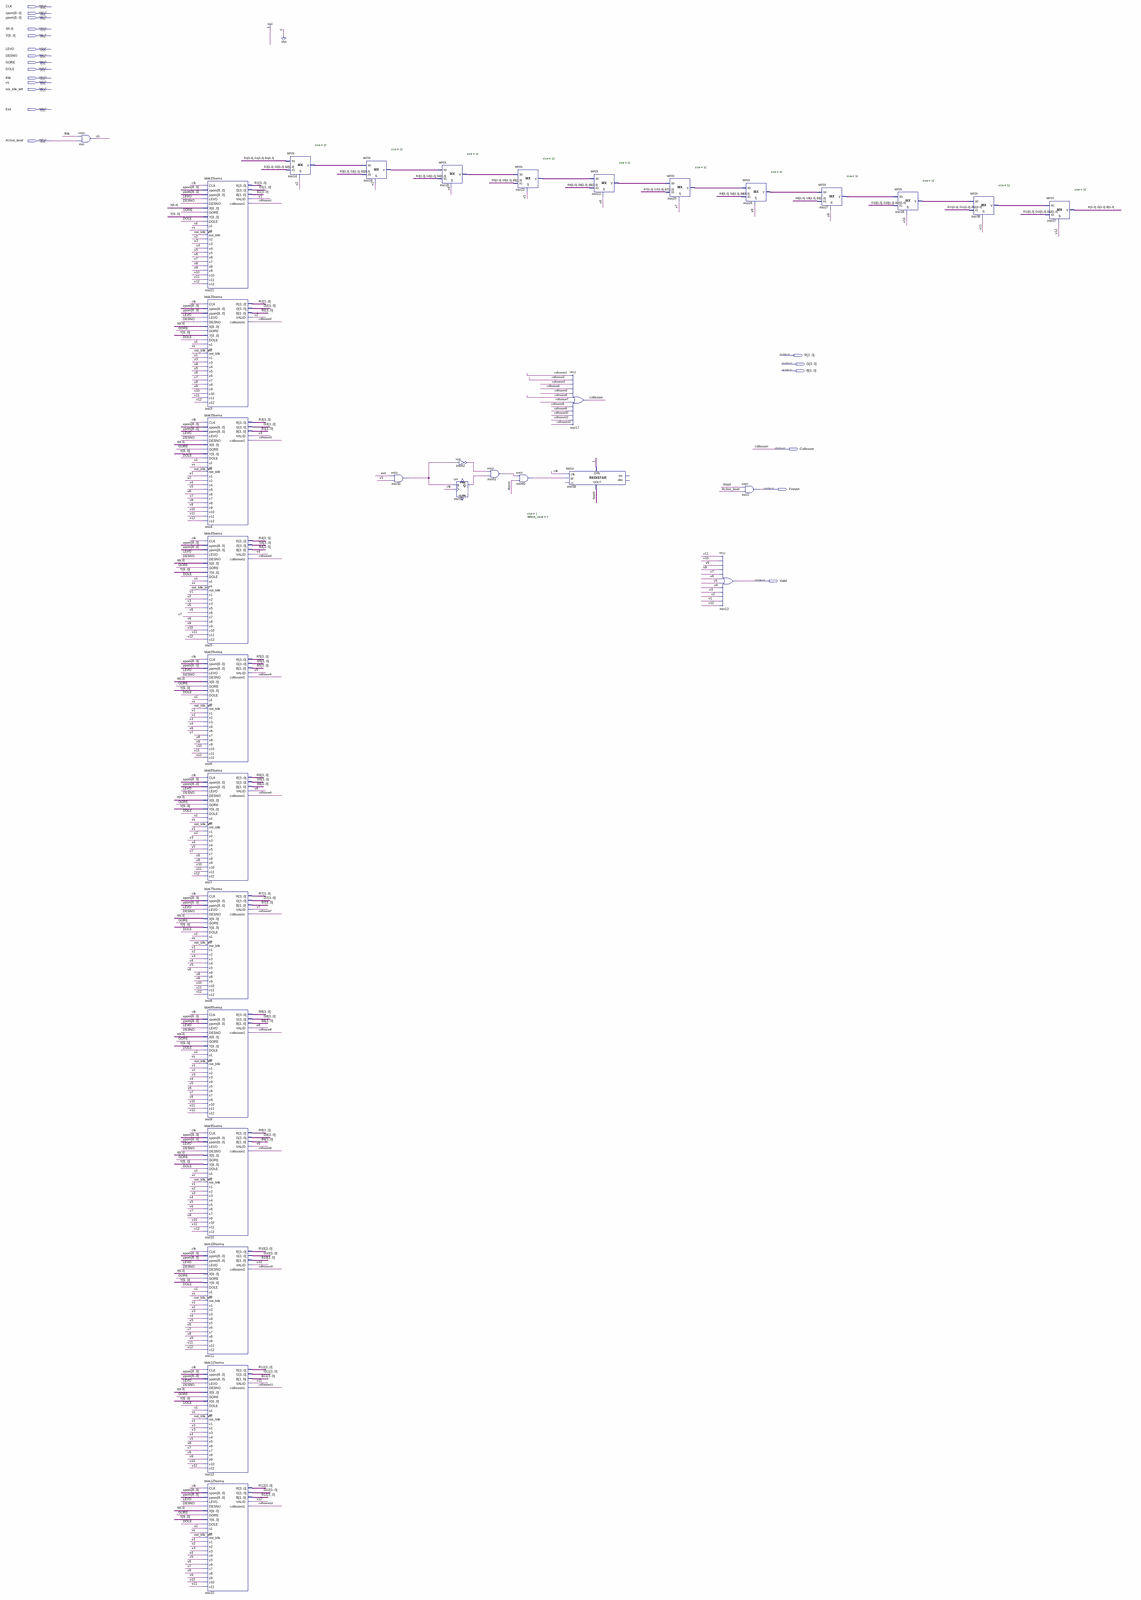
[diagram p0: schematic sheet, whole]
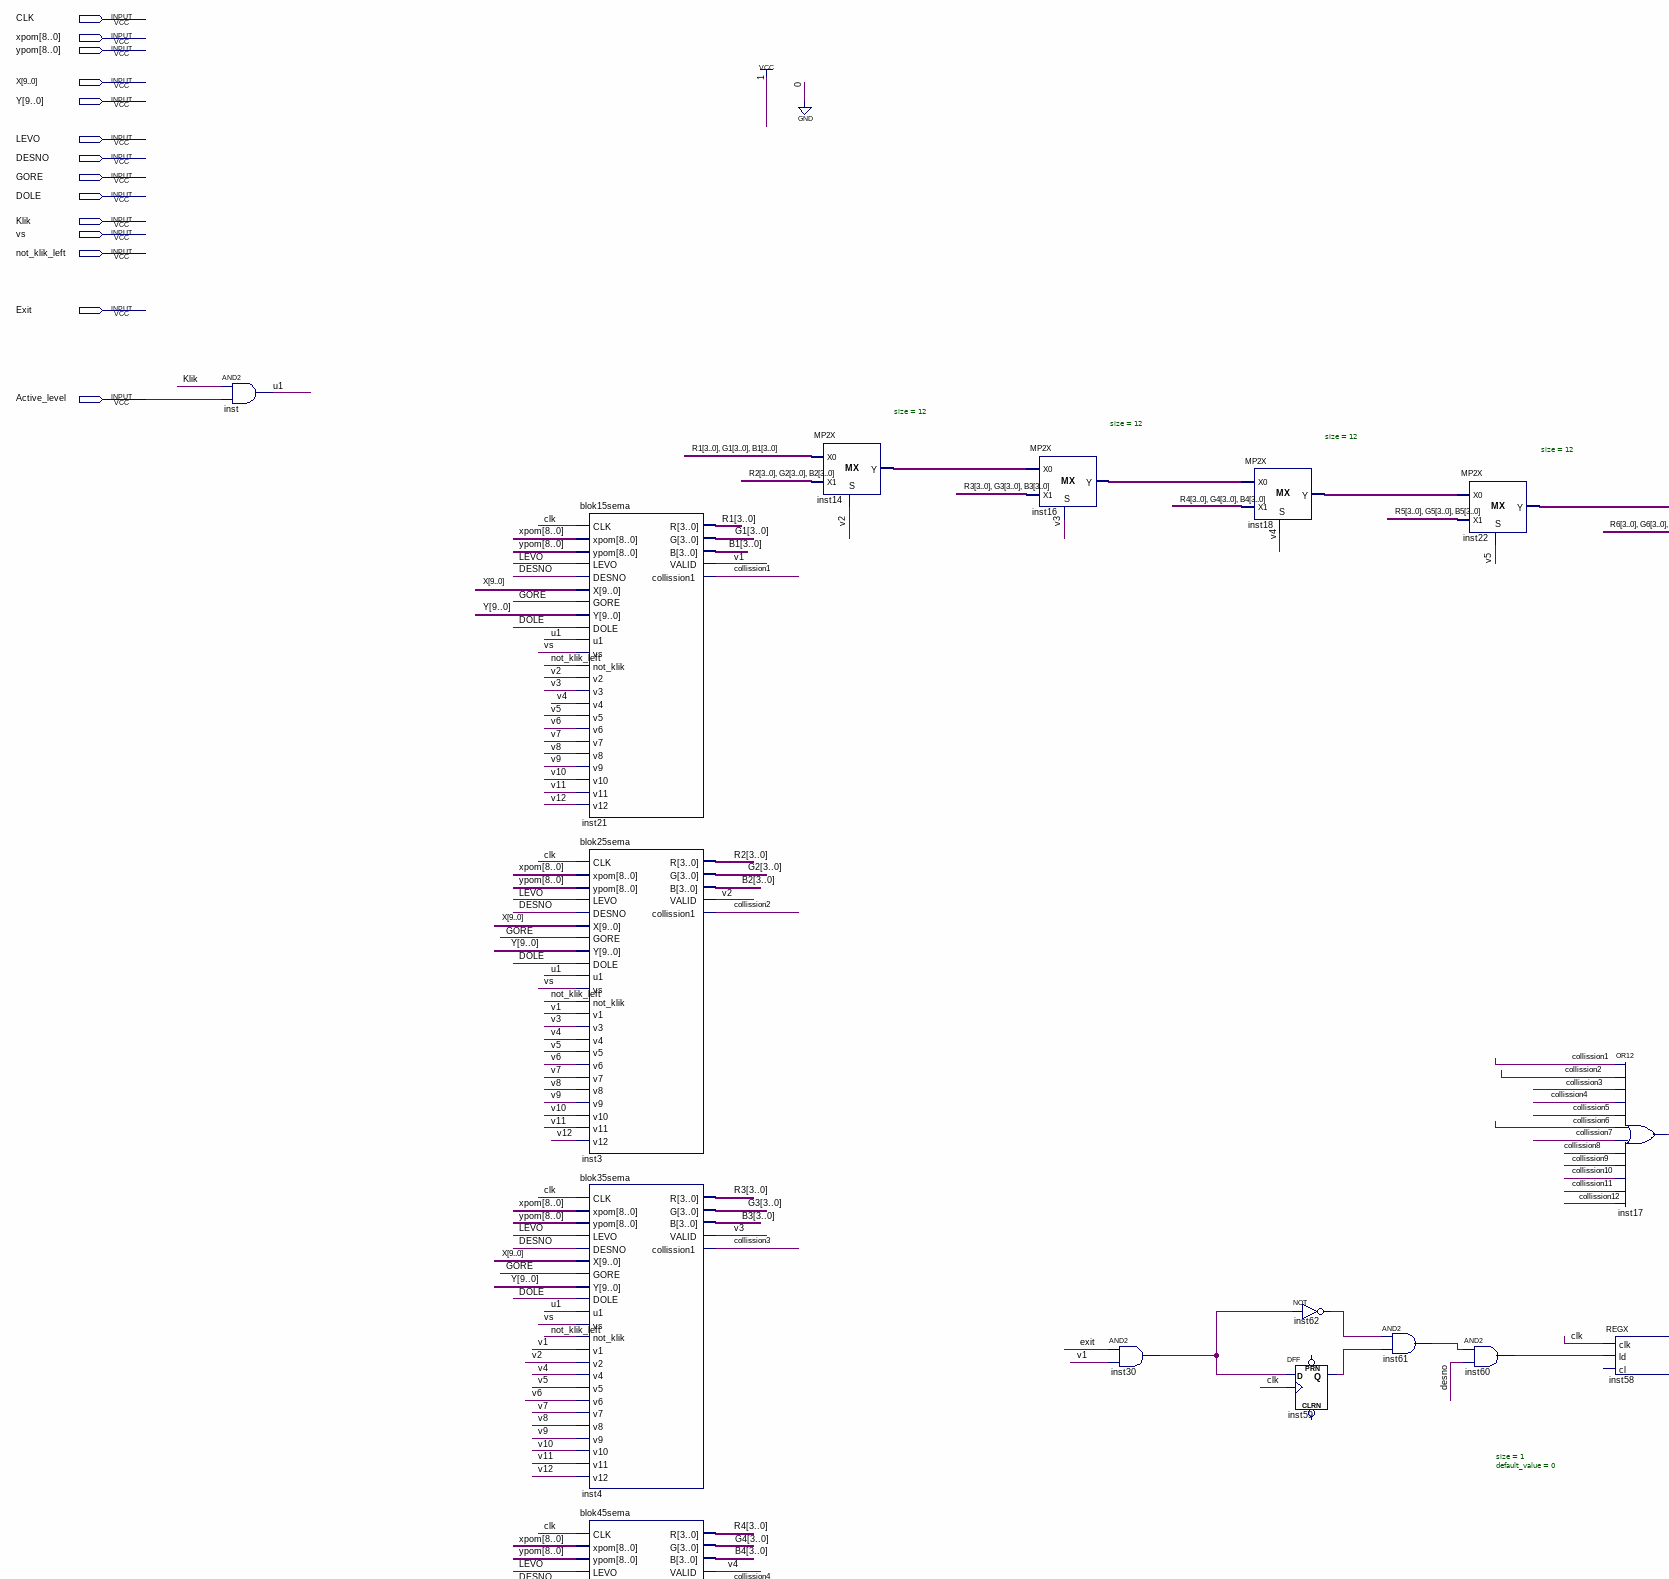
[diagram p1: schematic sheet, upper left part]
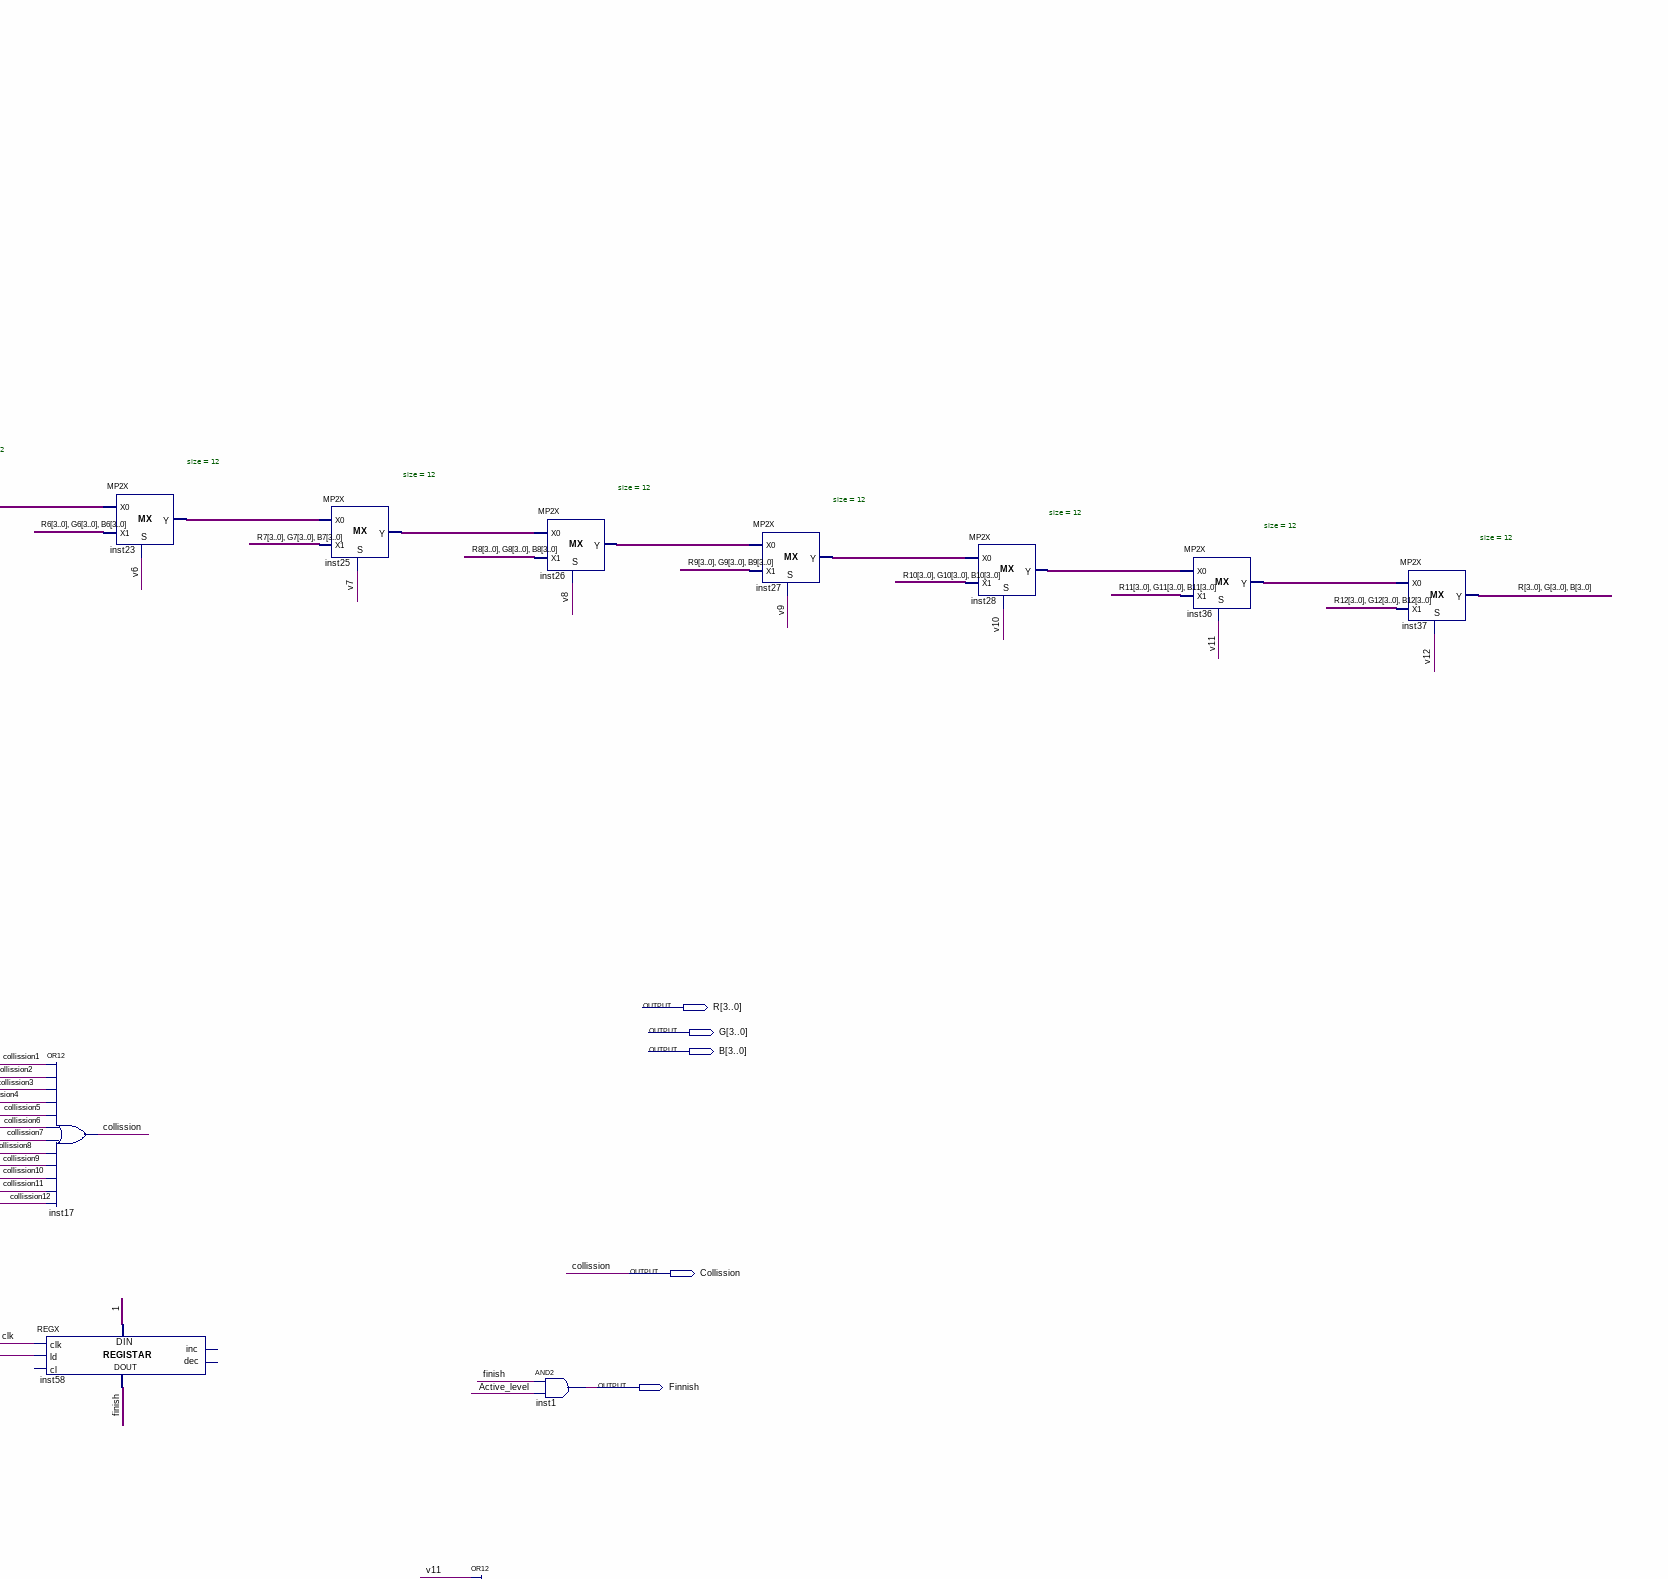
[diagram p2: schematic sheet, upper right part]
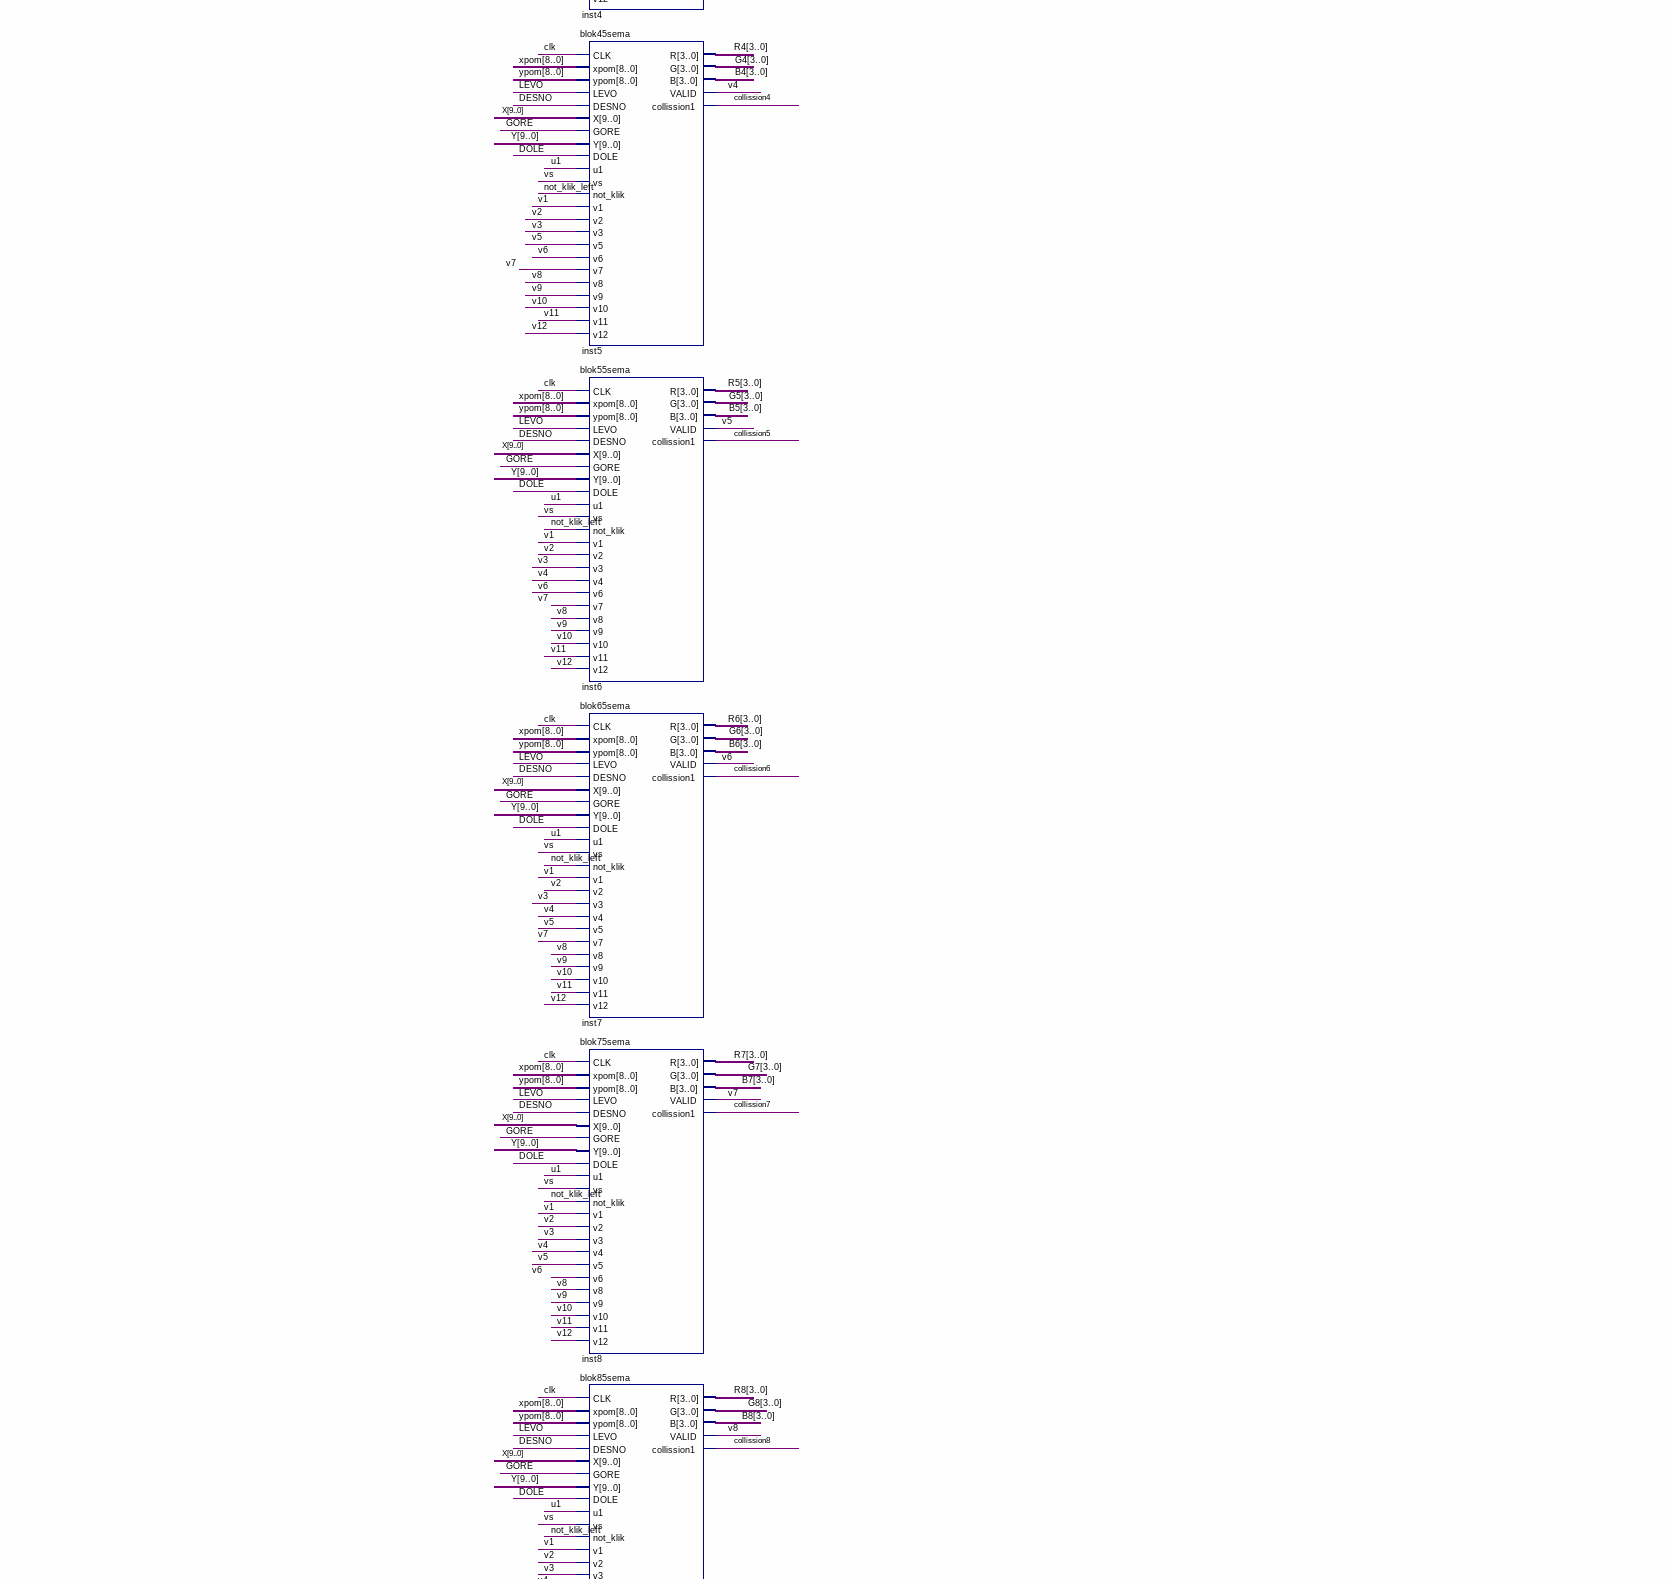
[diagram p3: schematic sheet, middle left part]
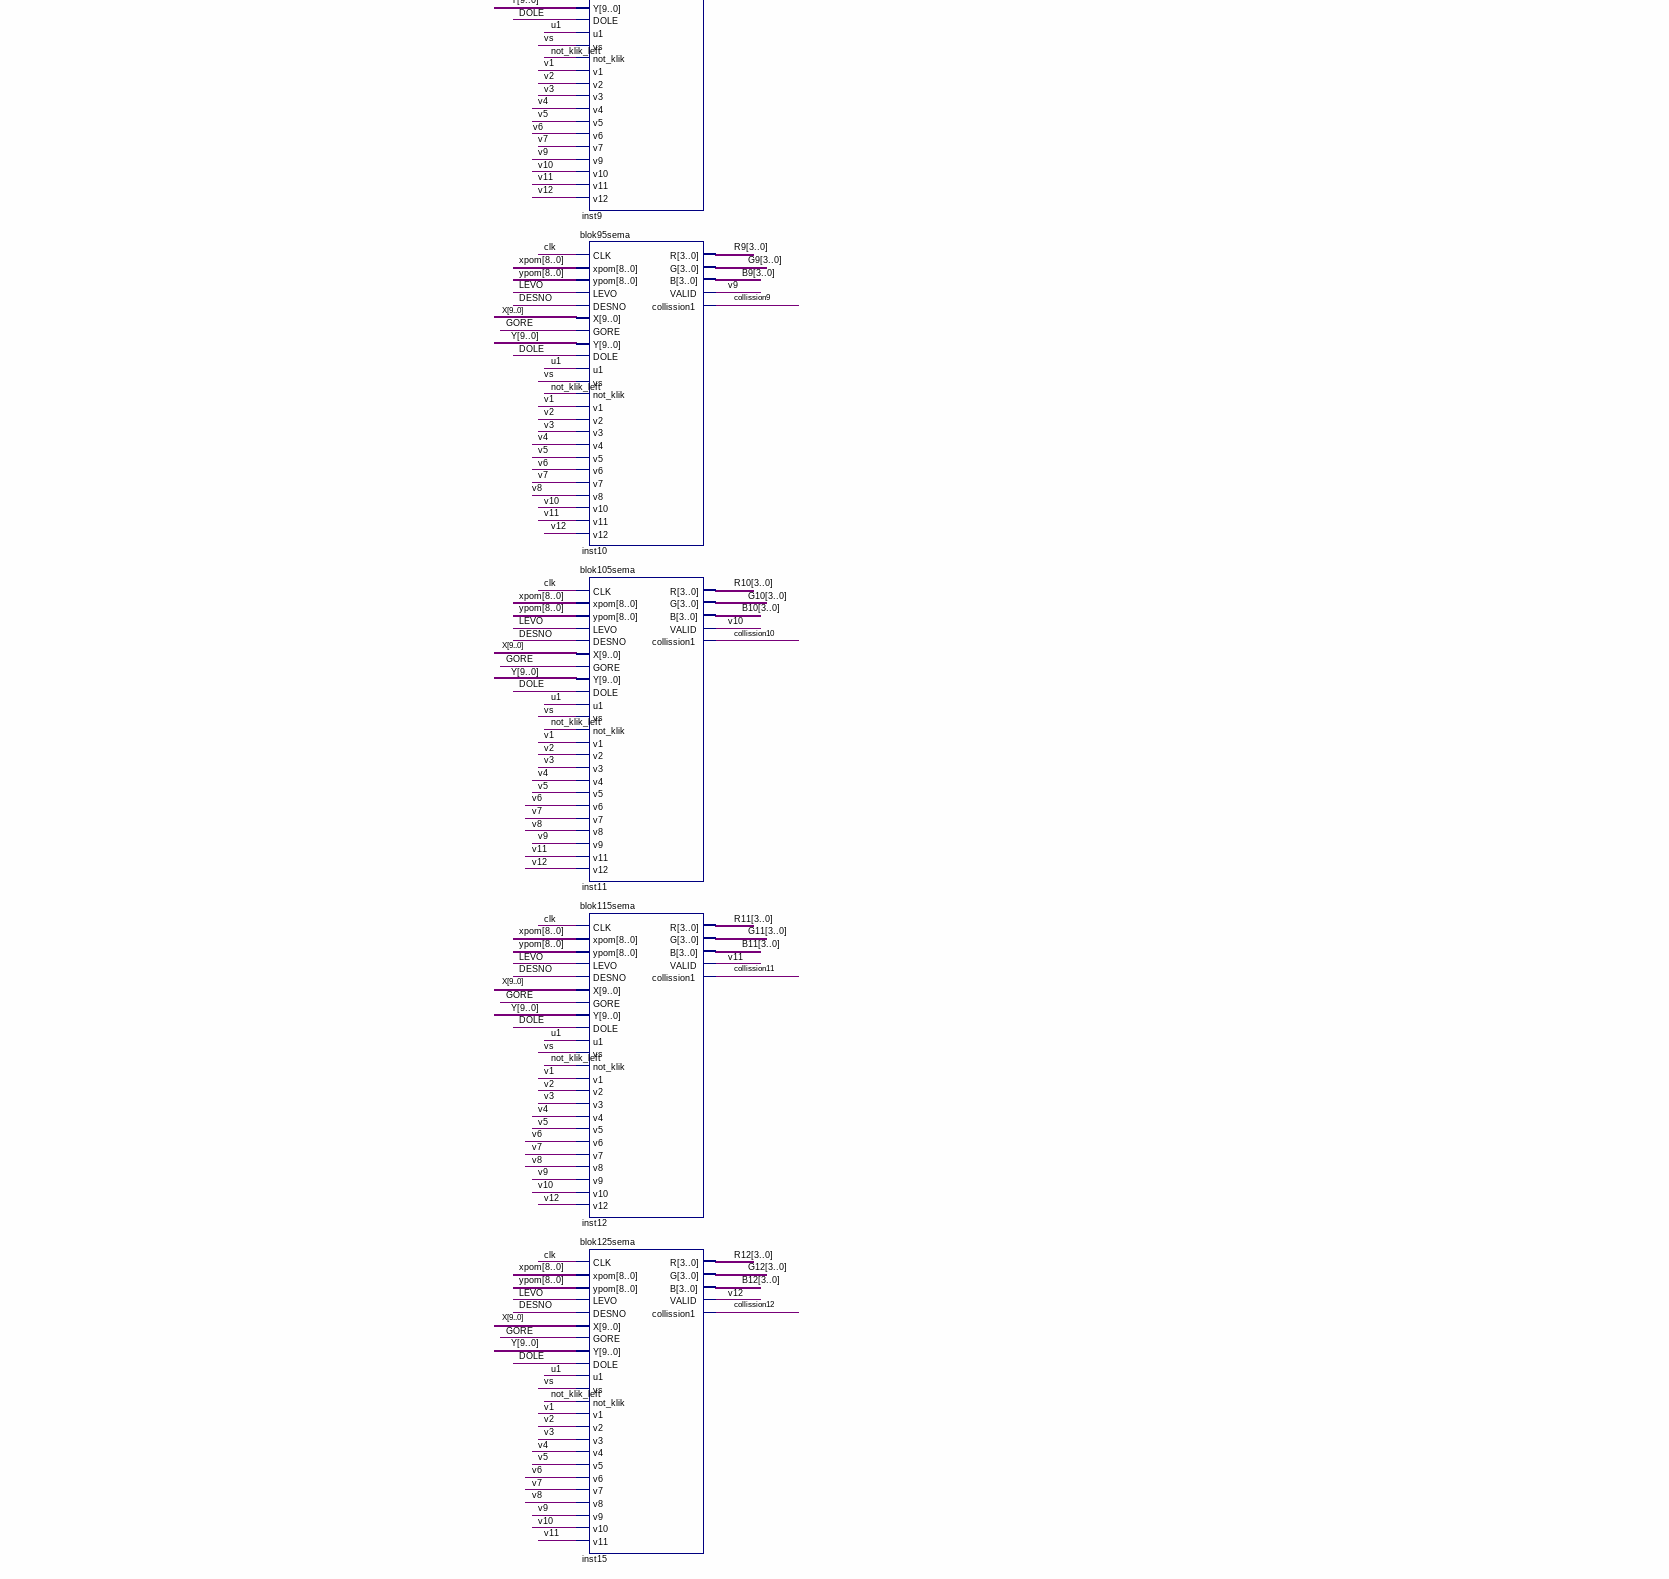
[diagram p4: schematic sheet, lower left part]
// Quartus schematic Level5.bdf as structural Verilog: 33 symbols, 20 pins
module Level5 (
  input  CLK,
  input  [8:0] xpom,
  input  [8:0] ypom,
  input  [9:0] X,
  input  [9:0] Y,
  input  LEVO,
  input  DESNO,
  input  GORE,
  input  DOLE,
  input  Klik,
  input  vs,
  input  not_klik_left,
  input  Exit,
  input  Active_level,
  output [3:0] R,
  output [3:0] G,
  output [3:0] B,
  output Collission,
  output Finnish,
  output Valid
);

  wire collission1, collission2, collission3, collission4, collission5, collission6, collission7,
       collission8, collission9, collission10, collission11, collission12, finish, inst30_out, inst59_q,
       inst60_out, inst61_out, inst62_out, u1, v1, v2, v3, v4, v5, v6, v7, v8, v9, v10, v11, v12;
  wire [3:0] B1, B2, B3, B4, B5, B6, B7, B8, B9, B10, B11, B12, G1, G2, G3, G4, G5, G6, G7, G8, G9, G10, G11,
       G12, R1, R2, R3, R4, R5, R6, R7, R8, R9, R10, R11, R12;
  wire [11:0] inst14_y, inst16_y, inst18_y, inst22_y, inst23_y, inst25_y, inst26_y, inst27_y, inst28_y,
       inst36_y;

  and inst (u1, Klik, Active_level);
  blok15sema inst21 (
    .CLK(CLK), .xpom(xpom), .ypom(ypom), .LEVO(LEVO), .DESNO(DESNO), .X(X), .GORE(GORE), .Y(Y), .DOLE(DOLE),
    .u1(u1), .vs(vs), .not_klik(not_klik_left), .v2(v2), .v3(v3), .v4(v4), .v5(v5), .v6(v6), .v7(v7),
    .v8(v8), .v9(v9), .v10(v10), .v11(v11), .v12(v12), .R(R1), .G(G1), .B(B1), .VALID(v1),
    .collission1(collission1));
  blok25sema inst3 (
    .CLK(CLK), .xpom(xpom), .ypom(ypom), .LEVO(LEVO), .DESNO(DESNO), .X(X), .GORE(GORE), .Y(Y), .DOLE(DOLE),
    .u1(u1), .vs(vs), .not_klik(not_klik_left), .v1(v1), .v3(v3), .v4(v4), .v5(v5), .v6(v6), .v7(v7),
    .v8(v8), .v9(v9), .v10(v10), .v11(v11), .v12(v12), .R(R2), .G(G2), .B(B2), .VALID(v2),
    .collission1(collission2));
  blok35sema inst4 (
    .CLK(CLK), .xpom(xpom), .ypom(ypom), .LEVO(LEVO), .DESNO(DESNO), .X(X), .GORE(GORE), .Y(Y), .DOLE(DOLE),
    .u1(u1), .vs(vs), .not_klik(not_klik_left), .v1(v1), .v2(v2), .v4(v4), .v5(v5), .v6(v6), .v7(v7),
    .v8(v8), .v9(v9), .v10(v10), .v11(v11), .v12(v12), .R(R3), .G(G3), .B(B3), .VALID(v3),
    .collission1(collission3));
  blok45sema inst5 (
    .CLK(CLK), .xpom(xpom), .ypom(ypom), .LEVO(LEVO), .DESNO(DESNO), .X(X), .GORE(GORE), .Y(Y), .DOLE(DOLE),
    .u1(u1), .vs(vs), .not_klik(not_klik_left), .v1(v1), .v2(v2), .v3(v3), .v5(v5), .v6(v6), .v7(v7),
    .v8(v8), .v9(v9), .v10(v10), .v11(v11), .v12(v12), .R(R4), .G(G4), .B(B4), .VALID(v4),
    .collission1(collission4));
  blok55sema inst6 (
    .CLK(CLK), .xpom(xpom), .ypom(ypom), .LEVO(LEVO), .DESNO(DESNO), .X(X), .GORE(GORE), .Y(Y), .DOLE(DOLE),
    .u1(u1), .vs(vs), .not_klik(not_klik_left), .v1(v1), .v2(v2), .v3(v3), .v4(v4), .v6(v6), .v7(v7),
    .v8(v8), .v9(v9), .v10(v10), .v11(v11), .v12(v12), .R(R5), .G(G5), .B(B5), .VALID(v5),
    .collission1(collission5));
  blok65sema inst7 (
    .CLK(CLK), .xpom(xpom), .ypom(ypom), .LEVO(LEVO), .DESNO(DESNO), .X(X), .GORE(GORE), .Y(Y), .DOLE(DOLE),
    .u1(u1), .vs(vs), .not_klik(not_klik_left), .v1(v1), .v2(v2), .v3(v3), .v4(v4), .v5(v5), .v7(v7),
    .v8(v8), .v9(v9), .v10(v10), .v11(v11), .v12(v12), .R(R6), .G(G6), .B(B6), .VALID(v6),
    .collission1(collission6));
  blok75sema inst8 (
    .CLK(CLK), .xpom(xpom), .ypom(ypom), .LEVO(LEVO), .DESNO(DESNO), .X(X), .GORE(GORE), .Y(Y), .DOLE(DOLE),
    .u1(u1), .vs(vs), .not_klik(not_klik_left), .v1(v1), .v2(v2), .v3(v3), .v4(v4), .v5(v5), .v6(v6),
    .v8(v8), .v9(v9), .v10(v10), .v11(v11), .v12(v12), .R(R7), .G(G7), .B(B7), .VALID(v7),
    .collission1(collission7));
  blok85sema inst9 (
    .CLK(CLK), .xpom(xpom), .ypom(ypom), .LEVO(LEVO), .DESNO(DESNO), .X(X), .GORE(GORE), .Y(Y), .DOLE(DOLE),
    .u1(u1), .vs(vs), .not_klik(not_klik_left), .v1(v1), .v2(v2), .v3(v3), .v4(v4), .v5(v5), .v6(v6),
    .v7(v7), .v9(v9), .v10(v10), .v11(v11), .v12(v12), .R(R8), .G(G8), .B(B8), .VALID(v8),
    .collission1(collission8));
  blok95sema inst10 (
    .CLK(CLK), .xpom(xpom), .ypom(ypom), .LEVO(LEVO), .DESNO(DESNO), .X(X), .GORE(GORE), .Y(Y), .DOLE(DOLE),
    .u1(u1), .vs(vs), .not_klik(not_klik_left), .v1(v1), .v2(v2), .v3(v3), .v4(v4), .v5(v5), .v6(v6),
    .v7(v7), .v8(v8), .v10(v10), .v11(v11), .v12(v12), .R(R9), .G(G9), .B(B9), .VALID(v9),
    .collission1(collission9));
  blok105sema inst11 (
    .CLK(CLK), .xpom(xpom), .ypom(ypom), .LEVO(LEVO), .DESNO(DESNO), .X(X), .GORE(GORE), .Y(Y), .DOLE(DOLE),
    .u1(u1), .vs(vs), .not_klik(not_klik_left), .v1(v1), .v2(v2), .v3(v3), .v4(v4), .v5(v5), .v6(v6),
    .v7(v7), .v8(v8), .v9(v9), .v11(v11), .v12(v12), .R(R10), .G(G10), .B(B10), .VALID(v10),
    .collission1(collission10));
  blok115sema inst12 (
    .CLK(CLK), .xpom(xpom), .ypom(ypom), .LEVO(LEVO), .DESNO(DESNO), .X(X), .GORE(GORE), .Y(Y), .DOLE(DOLE),
    .u1(u1), .vs(vs), .not_klik(not_klik_left), .v1(v1), .v2(v2), .v3(v3), .v4(v4), .v5(v5), .v6(v6),
    .v7(v7), .v8(v8), .v9(v9), .v10(v10), .v12(v12), .R(R11), .G(G11), .B(B11), .VALID(v11),
    .collission1(collission11));
  blok125sema inst15 (
    .CLK(CLK), .xpom(xpom), .ypom(ypom), .LEVO(LEVO), .DESNO(DESNO), .X(X), .GORE(GORE), .Y(Y), .DOLE(DOLE),
    .u1(u1), .vs(vs), .not_klik(not_klik_left), .v1(v1), .v2(v2), .v3(v3), .v4(v4), .v5(v5), .v6(v6),
    .v7(v7), .v8(v8), .v9(v9), .v10(v10), .v11(v11), .R(R12), .G(G12), .B(B12), .VALID(v12),
    .collission1(collission12));
  MP2X #(.size(12)) inst14 (.S(v2), .X0({R1, G1, B1}), .X1({R2, G2, B2}), .Y(inst14_y));
  MP2X #(.size(12)) inst16 (.S(v3), .X0(inst14_y), .X1({R3, G3, B3}), .Y(inst16_y));
  and inst30 (inst30_out, Exit, v1);
  MP2X #(.size(12)) inst18 (.S(v4), .X0(inst16_y), .X1({R4, G4, B4}), .Y(inst18_y));
  DFF inst59 (.CLK(CLK), .D(inst30_out), .Q(inst59_q));  // open: CLRN, PRN
  not inst62 (inst62_out, inst30_out);
  and inst61 (inst61_out, inst62_out, inst59_q);
  MP2X #(.size(12)) inst22 (.S(v5), .X0(inst18_y), .X1({R5, G5, B5}), .Y(inst22_y));
  and inst60 (inst60_out, inst61_out, DESNO);
  or inst17 (Collission, collission1, collission2, collission3, collission4, collission5, collission6, collission7, collission8, collission9, collission10, collission11, collission12);
  REGX #(.size(1), .default_value(0)) inst58 (
    .clk(CLK), .ld(inst60_out), .data_in(1'b1), .data_out(finish));  // open: cl, inc, dec
  MP2X #(.size(12)) inst23 (.S(v6), .X0(inst22_y), .X1({R6, G6, B6}), .Y(inst23_y));
  MP2X #(.size(12)) inst25 (.S(v7), .X0(inst23_y), .X1({R7, G7, B7}), .Y(inst25_y));
  or inst13 (Valid, v11, v10, v9, v8, v7, v6, v5, v4, v3, v2, v1, v12);
  MP2X #(.size(12)) inst26 (.S(v8), .X0(inst25_y), .X1({R8, G8, B8}), .Y(inst26_y));
  and inst1 (Finnish, finish, Active_level);
  MP2X #(.size(12)) inst27 (.S(v9), .X0(inst26_y), .X1({R9, G9, B9}), .Y(inst27_y));
  MP2X #(.size(12)) inst28 (.S(v10), .X0(inst27_y), .X1({R10, G10, B10}), .Y(inst28_y));
  MP2X #(.size(12)) inst36 (.S(v11), .X0(inst28_y), .X1({R11, G11, B11}), .Y(inst36_y));
  MP2X #(.size(12)) inst37 (.S(v12), .X0(inst36_y), .X1({R12, G12, B12}), .Y({R, G, B}));
endmodule
